# EAGLE design AnalogInputModule_r1 (EAGLE 7.7.0)
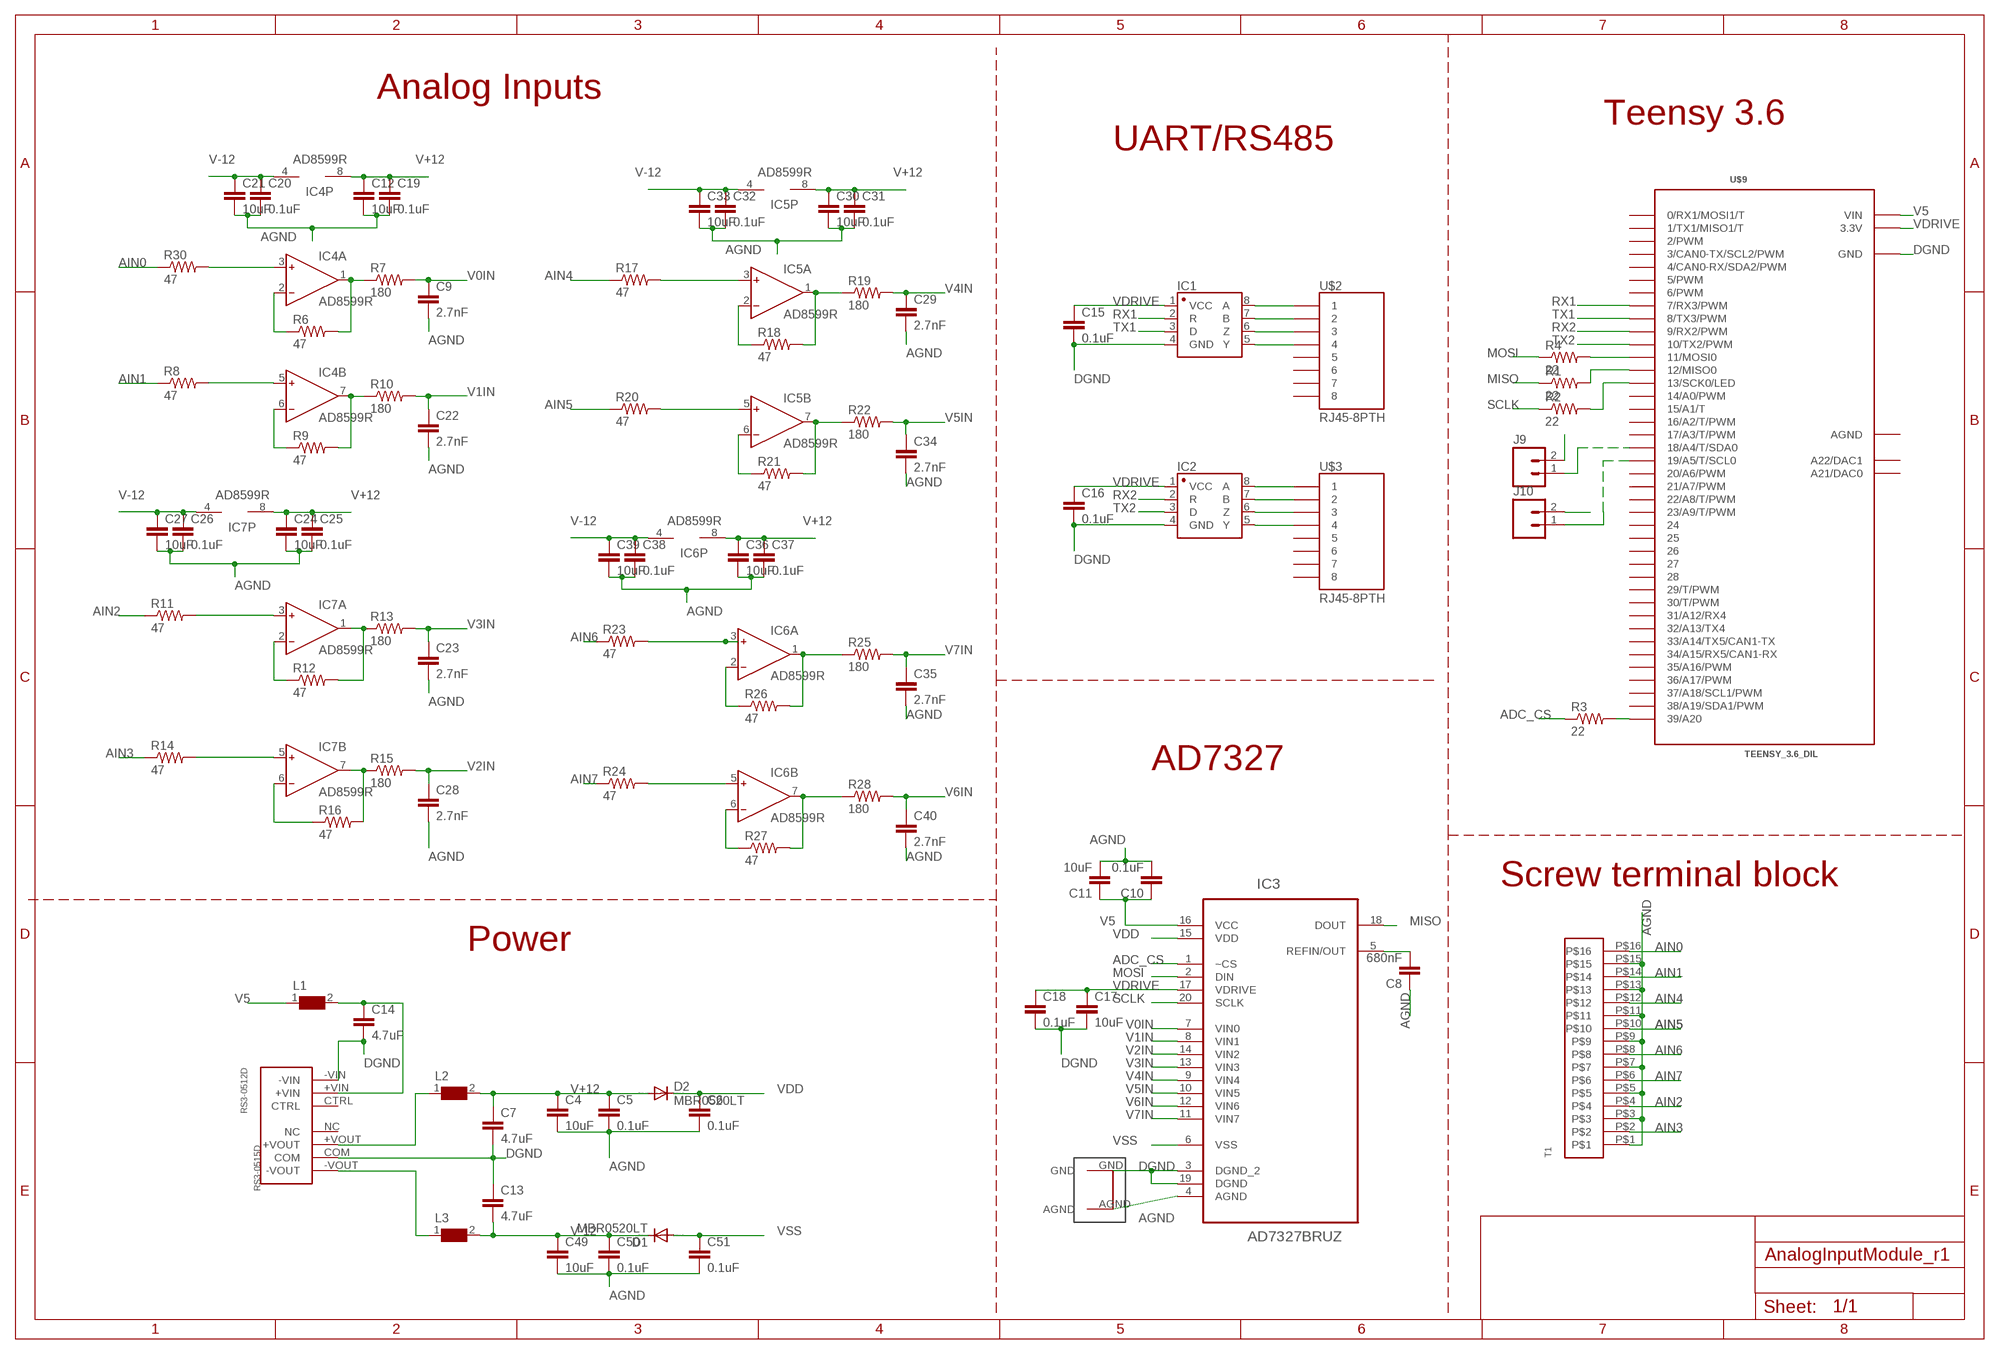
[diagram p0: schematic, sheet 1]

## Parts
C4  10uF  10UF-0805-10V-10%  [0805]
C5  0.1uF  1.0UF-0805-25V-10%  [0805]
C6  0.1uF  1.0UF-0805-25V-10%  [0805]
C7  4.7uF  4.7UF-1206-16V-(+80/-20%)  [1206]
C8  680nF  1.0UF-0805-25V-10%  [0805]
C9  2.7nF  1.0UF-0805-25V-10%  [0805]
C10  0.1uF  1.0UF-0805-25V-10%  [0805]
C11  10uF  10UF-0805-10V-10%  [0805]
C12  10uF  10UF-0805-10V-10%  [0805]
C13  4.7uF  4.7UF-1206-16V-(+80/-20%)  [1206]
C14  4.7uF  4.7UF-1206-16V-(+80/-20%)  [1206]
C15  0.1uF  1.0UF-0805-25V-10%  [0805]
C16  0.1uF  1.0UF-0805-25V-10%  [0805]
C17  10uF  10UF-0805-10V-10%  [0805]
C18  0.1uF  1.0UF-0805-25V-10%  [0805]
C19  0.1uF  1.0UF-0805-25V-10%  [0805]
C20  0.1uF  1.0UF-0805-25V-10%  [0805]
C21  10uF  10UF-0805-10V-10%  [0805]
C22  2.7nF  1.0UF-0805-25V-10%  [0805]
C23  2.7nF  1.0UF-0805-25V-10%  [0805]
C24  10uF  10UF-0805-10V-10%  [0805]
C25  0.1uF  1.0UF-0805-25V-10%  [0805]
C26  0.1uF  1.0UF-0805-25V-10%  [0805]
C27  10uF  10UF-0805-10V-10%  [0805]
C28  2.7nF  1.0UF-0805-25V-10%  [0805]
C29  2.7nF  1.0UF-0805-25V-10%  [0805]
C30  10uF  10UF-0805-10V-10%  [0805]
C31  0.1uF  1.0UF-0805-25V-10%  [0805]
C32  0.1uF  1.0UF-0805-25V-10%  [0805]
C33  10uF  10UF-0805-10V-10%  [0805]
C34  2.7nF  1.0UF-0805-25V-10%  [0805]
C35  2.7nF  1.0UF-0805-25V-10%  [0805]
C36  10uF  10UF-0805-10V-10%  [0805]
C37  0.1uF  1.0UF-0805-25V-10%  [0805]
C38  0.1uF  1.0UF-0805-25V-10%  [0805]
C39  10uF  10UF-0805-10V-10%  [0805]
C40  2.7nF  1.0UF-0805-25V-10%  [0805]
C49  10uF  10UF-0805-10V-10%  [0805]
C50  0.1uF  1.0UF-0805-25V-10%  [0805]
C51  0.1uF  1.0UF-0805-25V-10%  [0805]
D1  MBR0520LT  [SOD123]
D2  MBR0520LT  [SOD123]
IC1  SN65HVD31DR  [SO08]
IC2  SN65HVD31DR  [SO08]
IC3  AD7327BRUZ  [SOP65P640X120-20N]
IC4  AD8599R  [SO8]
IC5  AD8599R  [SO8]
IC6  AD8599R  [SO8]
IC7  AD8599R  [SO8]
J9  M023.5MM  [SCREWTERMINAL-3.5MM-2]
J10  M023.5MM  [SCREWTERMINAL-3.5MM-2]
L1  WE-CBF-742792118_1206  [1206]
L2  WE-CBF-742792118_1206  [1206]
L3  WE-CBF-742792118_1206  [1206]
R1  22  R-US_R0805  [R0805]
R2  22  R-US_R0805  [R0805]
R3  22  R-US_R0805  [R0805]
R4  22  R-US_R0805  [R0805]
R6  47  R-US_R0805  [R0805]
R7  180  R-US_R0805  [R0805]
R8  47  R-US_R0805  [R0805]
R9  47  R-US_R0805  [R0805]
R10  180  R-US_R0805  [R0805]
R11  47  R-US_R0805  [R0805]
R12  47  R-US_R0805  [R0805]
R13  180  R-US_R0805  [R0805]
R14  47  R-US_R0805  [R0805]
R15  180  R-US_R0805  [R0805]
R16  47  R-US_R0805  [R0805]
R17  47  R-US_R0805  [R0805]
R18  47  R-US_R0805  [R0805]
R19  180  R-US_R0805  [R0805]
R20  47  R-US_R0805  [R0805]
R21  47  R-US_R0805  [R0805]
R22  180  R-US_R0805  [R0805]
R23  47  R-US_R0805  [R0805]
R24  47  R-US_R0805  [R0805]
R25  180  R-US_R0805  [R0805]
R26  47  R-US_R0805  [R0805]
R27  47  R-US_R0805  [R0805]
R28  180  R-US_R0805  [R0805]
R30  47  R-US_R0805  [R0805]
RS3-0512D  RS3-0515D  [RS3-0515D]
T1  16POS_SCREWTERMINAL  [16POS_SCREWTERMINAL]
U$2  RJ45-8PTH  [RJ45-8]
U$3  RJ45-8PTH  [RJ45-8]
U$4  GNDPLANESHRT  [GNDPLANESHRT]
U$9  TEENSY_3.6_DIL  [TEENSY_3.6_DIL]

## Nets
+VOUT: L2.1 RS3-0512D.+VOUT
-VOUT: L3.1 RS3-0512D.-VOUT
ADC_CS: IC3.1(~CS) R3.1
AGND: C4.2 C5.2 C6.2 C8.1 C9.2 C10.2 C11.2 C12.2 C19.2 C20.2 C21.2 C22.2 C23.2 C24.2 C25.2 C26.2 C27.2 C28.2 C29.2 C30.2 C31.2 C32.2 C33.2 C34.2 C35.2 C36.2 C37.2 C38.2 C39.2 C40.2 C49.2 C50.2 C51.2 IC3.4(AGND) T1.P$1 T1.P$3 T1.P$5 T1.P$7 T1.P$9 T1.P$11 T1.P$13 T1.P$15 U$4.AGND
AIN0: R30.1 T1.P$16
AIN1: R8.1 T1.P$14
AIN2: R11.1 T1.P$4
AIN3: R14.1 T1.P$2
AIN4: R17.1 T1.P$12
AIN5: R20.1 T1.P$10
AIN6: R23.1 T1.P$8
AIN7: R24.1 T1.P$6
DGND: C7.2 C13.1 C14.2 C15.2 C16.2 C17.2 C18.2 IC1.4(GND) IC2.4(GND) IC3.3(DGND_2) IC3.19(DGND) J9.2 J10.2 RS3-0512D.-VIN RS3-0512D.COM U$4.GND U$9.GND U$9.GND1(GND)
MISO: IC3.18(DOUT) R1.1
MOSI: IC3.2(DIN) R4.1
N$1: IC1.6(Z) U$2.3
N$3: IC1.8(A) U$2.1
N$4: IC1.5(Y) U$2.4
N$5: IC1.7(B) U$2.2
N$6: IC2.6(Z) U$3.3
N$7: IC2.5(Y) U$3.4
N$8: IC2.8(A) U$3.1
N$9: IC2.7(B) U$3.2
N$10: R4.2 U$9.11(11/MOSI0)
N$11: R1.2 U$9.12(12/MISO0)
N$12: C14.1 L1.2 RS3-0512D.+VIN
N$13: R3.2 U$9.39/A20
N$14: IC4.3(A:IN+) R30.2
N$15: R2.2 U$9.13(13/SCK0/LED)
N$16: IC4.2(A:IN-) R6.1
N$17: IC4.1(A:OUT) R6.2 R7.1
N$18: J9.1 U$9.18/A4(18/A4/T/SDA0)
N$19: J10.1 U$9.19/A5(19/A5/T/SCL0)
N$20: IC4.5(B:IN+) R8.2
N$21: IC4.6(B:IN-) R9.1
N$22: IC4.7(B:OUT) R9.2 R10.1
N$23: IC7.3(A:IN+) R11.2
N$24: IC7.2(A:IN-) R12.1
N$25: IC7.1(A:OUT) R12.2 R13.1
N$28: IC7.5(B:IN+) R14.2
N$29: IC7.6(B:IN-) R16.1
N$30: IC7.7(B:OUT) R15.1 R16.2
N$31: IC5.3(A:IN+) R17.2
N$32: IC5.2(A:IN-) R18.1
N$33: IC5.1(A:OUT) R18.2 R19.1
N$36: IC5.5(B:IN+) R20.2
N$37: IC5.6(B:IN-) R21.1
N$38: IC5.7(B:OUT) R21.2 R22.1
N$39: IC6.3(A:IN+) R23.2
N$40: IC6.2(A:IN-) R26.1
N$41: IC6.1(A:OUT) R25.1 R26.2
N$44: IC6.5(B:IN+) R24.2
N$45: IC6.6(B:IN-) R27.1
N$46: IC6.7(B:OUT) R27.2 R28.1
REF: C8.2 IC3.5(REFIN/OUT)
RX1: IC1.2(R) U$9.7(7/RX3/PWM)
RX2: IC2.2(R) U$9.9(9/RX2/PWM)
SCLK: IC3.20(SCLK) R2.1
TX1: IC1.3(D) U$9.8(8/TX3/PWM)
TX2: IC2.3(D) U$9.10(10/TX2/PWM)
V0IN: C9.1 IC3.7(VIN0) R7.2
V1IN: C22.1 IC3.8(VIN1) R10.2
V2IN: C28.1 IC3.14(VIN2) R15.2
V3IN: C23.1 IC3.13(VIN3) R13.2
V4IN: C29.1 IC3.9(VIN4) R19.2
V5: C10.1 C11.1 IC3.16(VCC) L1.1 U$9.VIN
V5IN: C34.1 IC3.10(VIN5) R22.2
V6IN: C40.1 IC3.12(VIN6) R28.2
V7IN: C35.1 IC3.11(VIN7) R25.2
V+12: C4.1 C5.1 C7.1 C12.1 C19.1 C24.1 C25.1 C30.1 C31.1 C36.1 C37.1 D2.A IC4.8(P:V+) IC5.8(P:V+) IC6.8(P:V+) IC7.8(P:V+) L2.2
V-12: C13.2 C20.1 C21.1 C26.1 C27.1 C32.1 C33.1 C38.1 C39.1 C49.1 C50.1 D1.C IC4.4(P:V-) IC5.4(P:V-) IC6.4(P:V-) IC7.4(P:V-) L3.2
VDD: C6.1 D2.C IC3.15(VDD)
VDRIVE: C15.1 C16.1 C17.1 C18.1 IC1.1(VCC) IC2.1(VCC) IC3.17(VDRIVE) U$9.3.3V U$9.3.3V3(3.3V)
VSS: C51.1 D1.A IC3.6(VSS)
Unconnected: RS3-0512D.CTRL RS3-0512D.NC U$2.5 U$2.6 U$2.7 U$2.8 U$3.5 U$3.6 U$3.7 U$3.8 U$9.0(0/RX1/MOSI1/T) U$9.1(1/TX1/MISO1/T) U$9.2(2/PWM) U$9.3(3/CAN0-TX/SCL2/PWM) U$9.4(4/CAN0-RX/SDA2/PWM) U$9.5(5/PWM) U$9.6(6/PWM) U$9.14/A0(14/A0/PWM) U$9.15/A1(15/A1/T) U$9.16/A2(16/A2/T/PWM) U$9.17/A3(17/A3/T/PWM) U$9.20/A6(20/A6/PWM) U$9.21/A7(21/A7/PWM) U$9.22/A8(22/A8/T/PWM) U$9.23/A9(23/A9/T/PWM) U$9.24 U$9.25 U$9.26 U$9.27 U$9.28 U$9.29(29/T/PWM) U$9.30(30/T/PWM) U$9.31/A12(31/A12/RX4) U$9.32/A13(32/A13/TX4) U$9.33/A14(33/A14/TX5/CAN1-TX) U$9.34/A15(34/A15/RX5/CAN1-RX) U$9.35/A16(35/A16/PWM) U$9.36/A17(36/A17/PWM) U$9.37/A18(37/A18/SCL1/PWM) U$9.38/A19(38/A19/SDA1/PWM) U$9.A21(A21/DAC0) U$9.A22(A22/DAC1)

## Notes on the sheet
- Analog Inputs
- Teensy 3.6
- UART/RS485
- AIN5
- AIN6
- AD7327
- AIN7
- Screw terminal block
- AGND
- Power | AIN0
- AIN1
- AIN4
- AIN5 | AIN5
- AIN6
- AIN7

## Power pins joined to a net without a drawn wire
AGND: U$9.AGND

## Library data of the parts
C4 C11 C12 C17 C21 C24 C27 C30 C33 C36 C39 C49 = SparkFun-Capacitors:10UF: 10.0µF ceramic capacitors A capacitor is a passive two-terminal electrical component used to store electrical energy temporarily in an electric field.; PROD_ID: CAP-11330
C5 C6 C8-C10 C15 C16 C18-C20 C22 C23 C25 C26 C28 C29 C31 C32 C34 C35 C37 C38 C40 C50 C51 = SparkFun-Capacitors:1.0UF: 1µF ceramic capacitors A capacitor is a passive two-terminal electrical component used to store electrical energy temporarily in an electric field.; PROD_ID: CAP-08064; VALUE: 1.0uF
C7 C13 C14 = SparkFun-Capacitors:4.7UF: 4.7µF ceramic capacitors A capacitor is a passive two-terminal electrical component used to store electrical energy temporarily in an electric field.; PROD_ID: CAP-10300
D1 D2 = diode:MBR0520LT: SCHOTTKY BARRIER RECTIFIER Source: http://onsemi.com .. MBR0520LT1-D.pdf
IC1 IC2 = Joshparts4:SN65HVD31DR: A placeholder for generic narrow & wide SOIC8 foorptints - used on the DIP adapter board.
IC3 = AD7327BRUZ:AD7327BRUZ: 500 kSPS, 8-Channel, Software-Selectable, True Bipolar Input, 12-Bit Plus Sign ADC; MPN: AD7327BRUZ; OC_FARNELL: 1274245; OC_NEWARK: 19M0860; PACKAGE: TSSOP-20; SUPPLIER: Analog devices
IC4-IC7 = analog-devices:AD8599: Single and Dual, Ultralow Distortion, Ultralow Noise Op Amps Source: http://www.analog.com/static/imported-files/data_sheets/AD8597_8599.pdf; MPN: AD8599ARZ; OC_FARNELL: 1438872; OC_NEWARK: 34M5072
J9 J10 = SparkFun-Connectors:M02: Standard 2-pin 0.1" header. Use with - straight break away headers ( PRT-00116) - right angle break away headers (PRT-00553) - swiss pins (PRT-00743) - machine pins (PRT-00117) - female headers (PRT-00115) Molex polarized connector foot print use with: PRT-08233 with associated crimp pins and housings. 2.54_SCREWTERM for use with PRT-10571. 3.5mm Screw Terminal footprints for PRT-08084 5mm Screw Terminal footprints for use with PRT-08432; PROD_ID: CONN-08399
L1-L3 = WE-CBF:WE-CBF: SMD EMI Suppression Ferrite Beads WE-CBF - Excellent anti-EMI properties - Low DC-restistance - Impedances till 3000 ohms - Rated current up to 6 A -- Reliable Ni-Sn electrodes -- Perfect as data lined filter and for uncoupling of distribution voltage; MPN: 742792118; OC_FARNELL: 1800374; OC_NEWARK: 78R5648; PACKAGE: IND-1206; SUPPLIER: Wuerth Elektronik
R1-R4 R6-R28 R30 = adafruit:R-US_: RESISTOR, American symbol
RS3-0512D = JoshParts10:RS3-0515D
T1 = JoshParts10:16POS_SCREWTERMINAL
U$2 U$3 = SparkFun:RJ45-8: RJ45 Jack Simple RJ45, 8-pin connection - connector for common Cat5, Cat5e, and Cat6 Ethernet cables. Footprint not yet proven in production. Connector sku is PRT-00643; Breakout PCB sku is BOB-00716.
U$4 = Joshparts2:GNDPLANESHRT
U$9 = Teensy_3_and_LC_Series_Boards_v1.4:TEENSY_3.6_DIL: Teensy 3.6 DIL Package

## Board
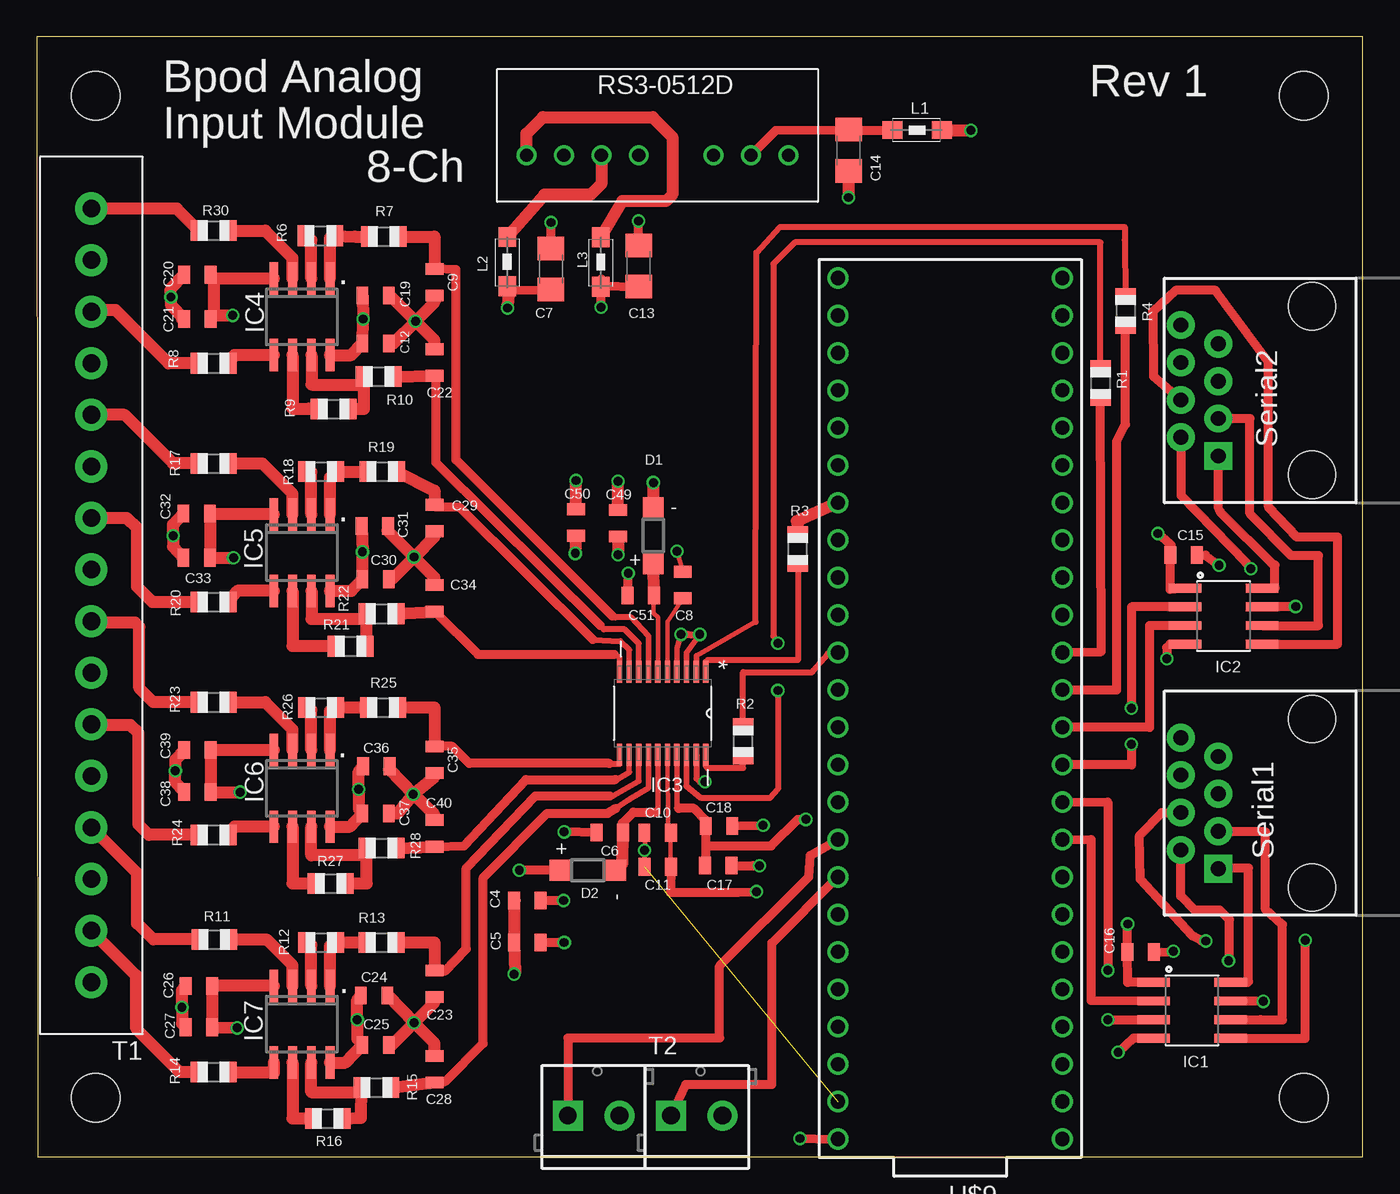
[diagram p1: board, top side]
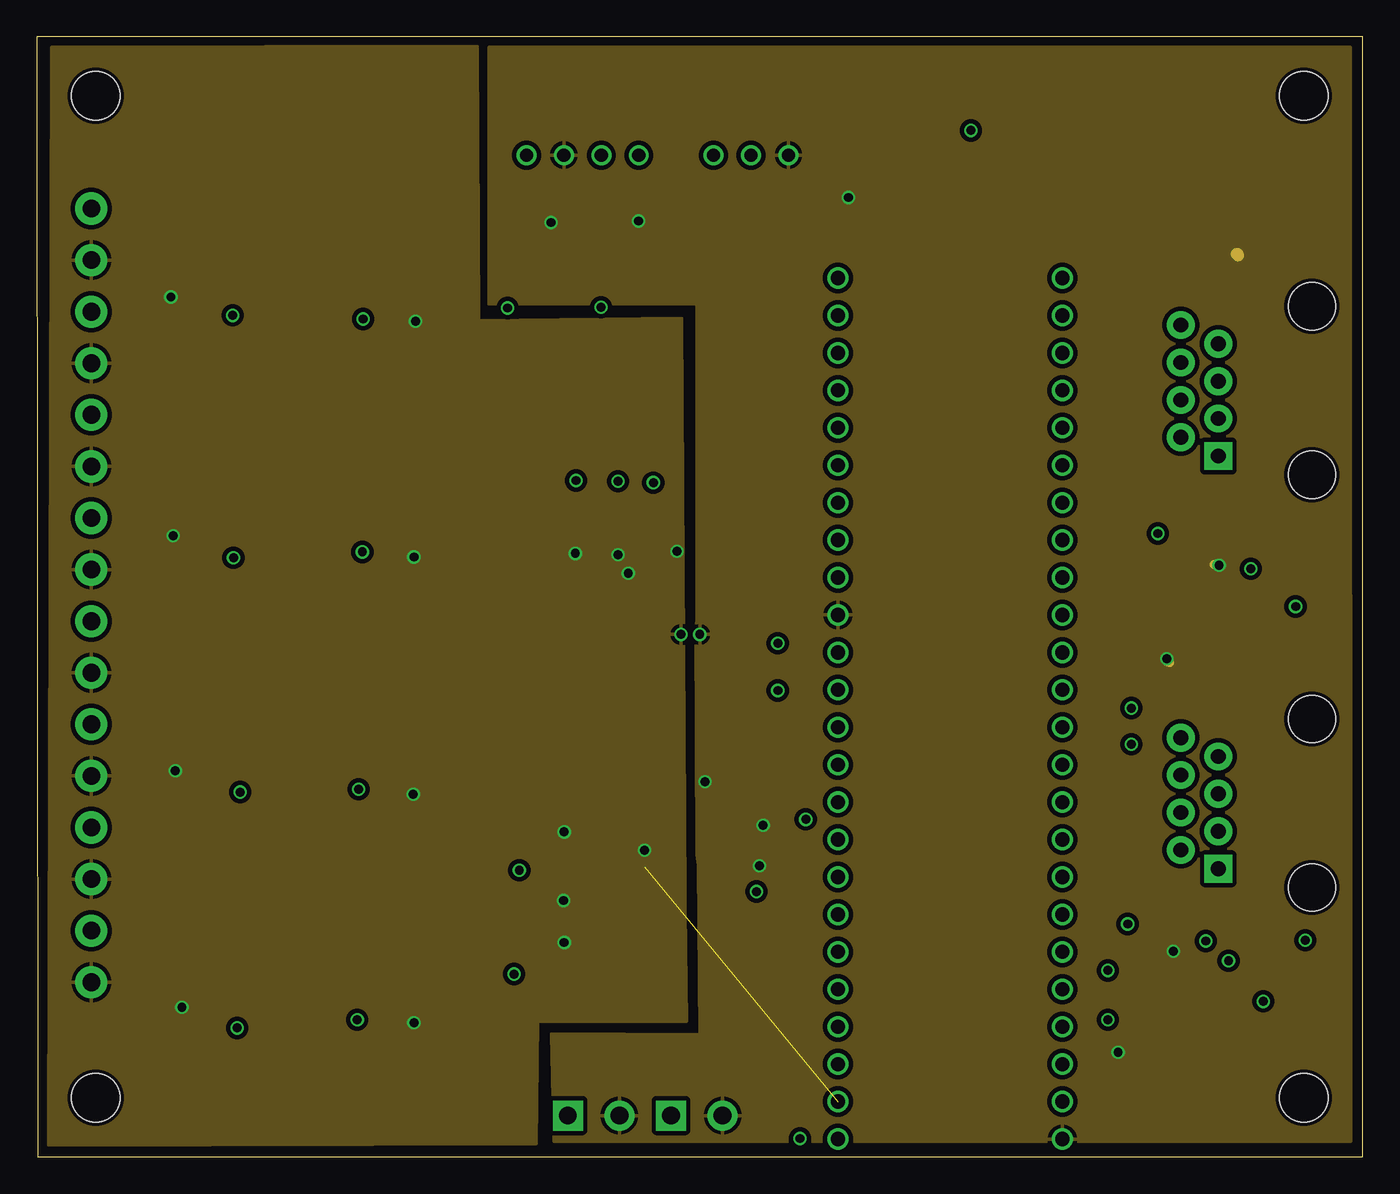
[diagram p2: board, inner layer Route2]
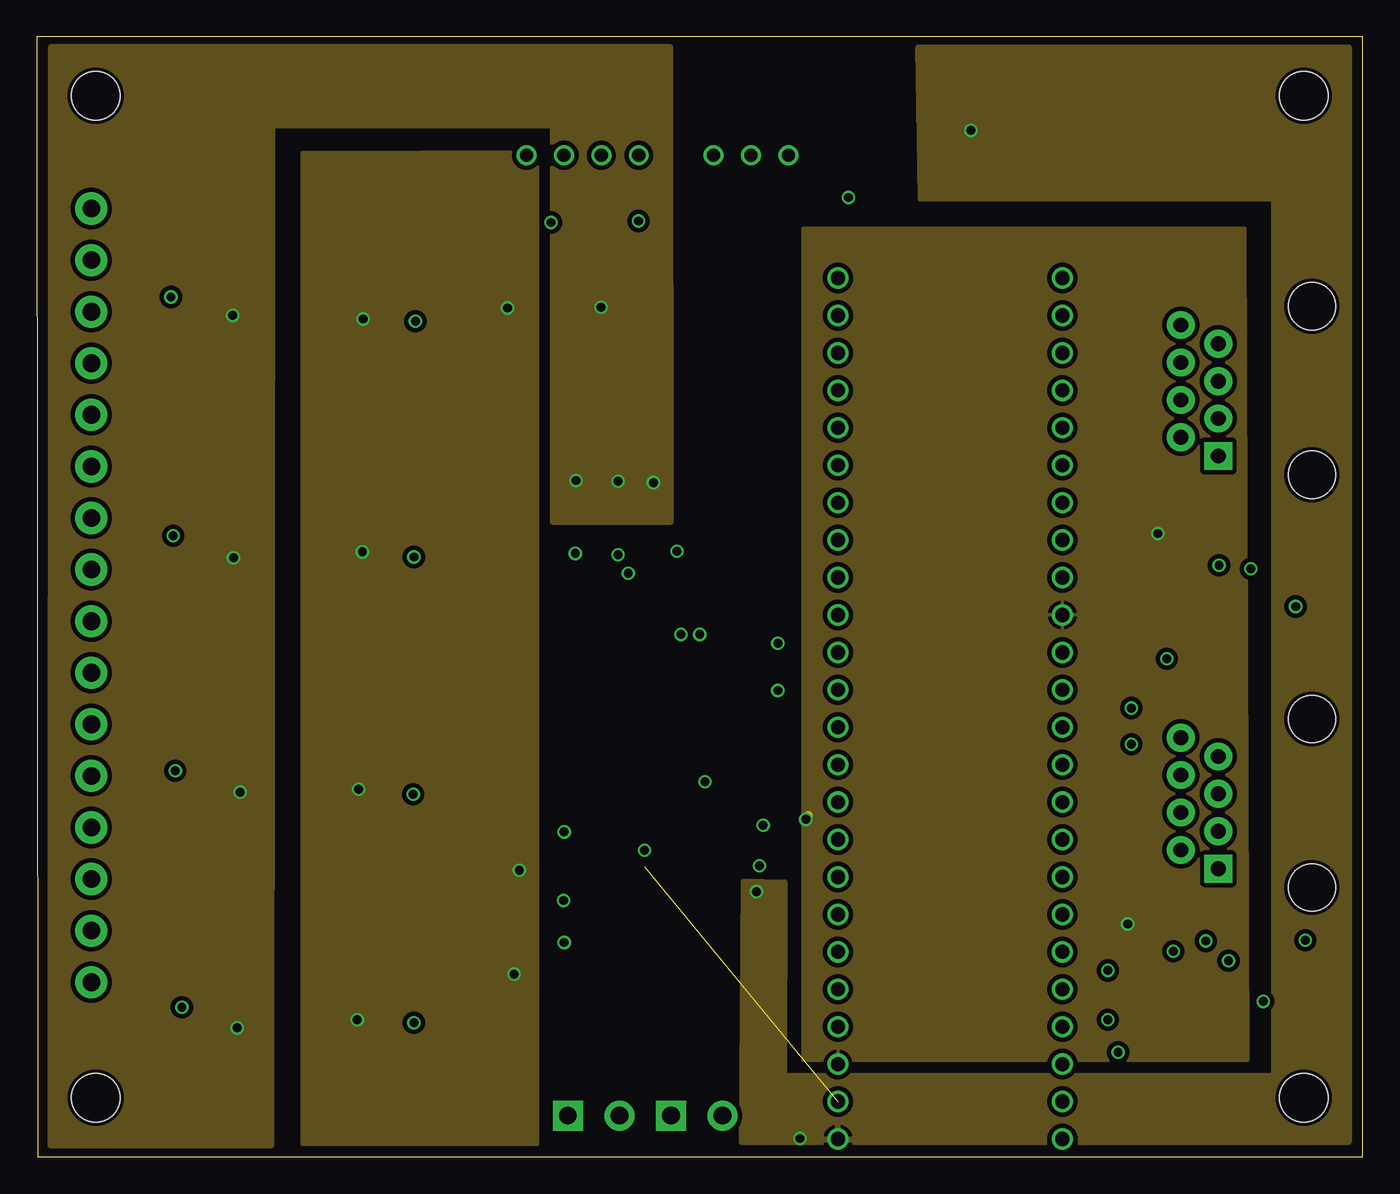
[diagram p3: board, inner layer Route15]
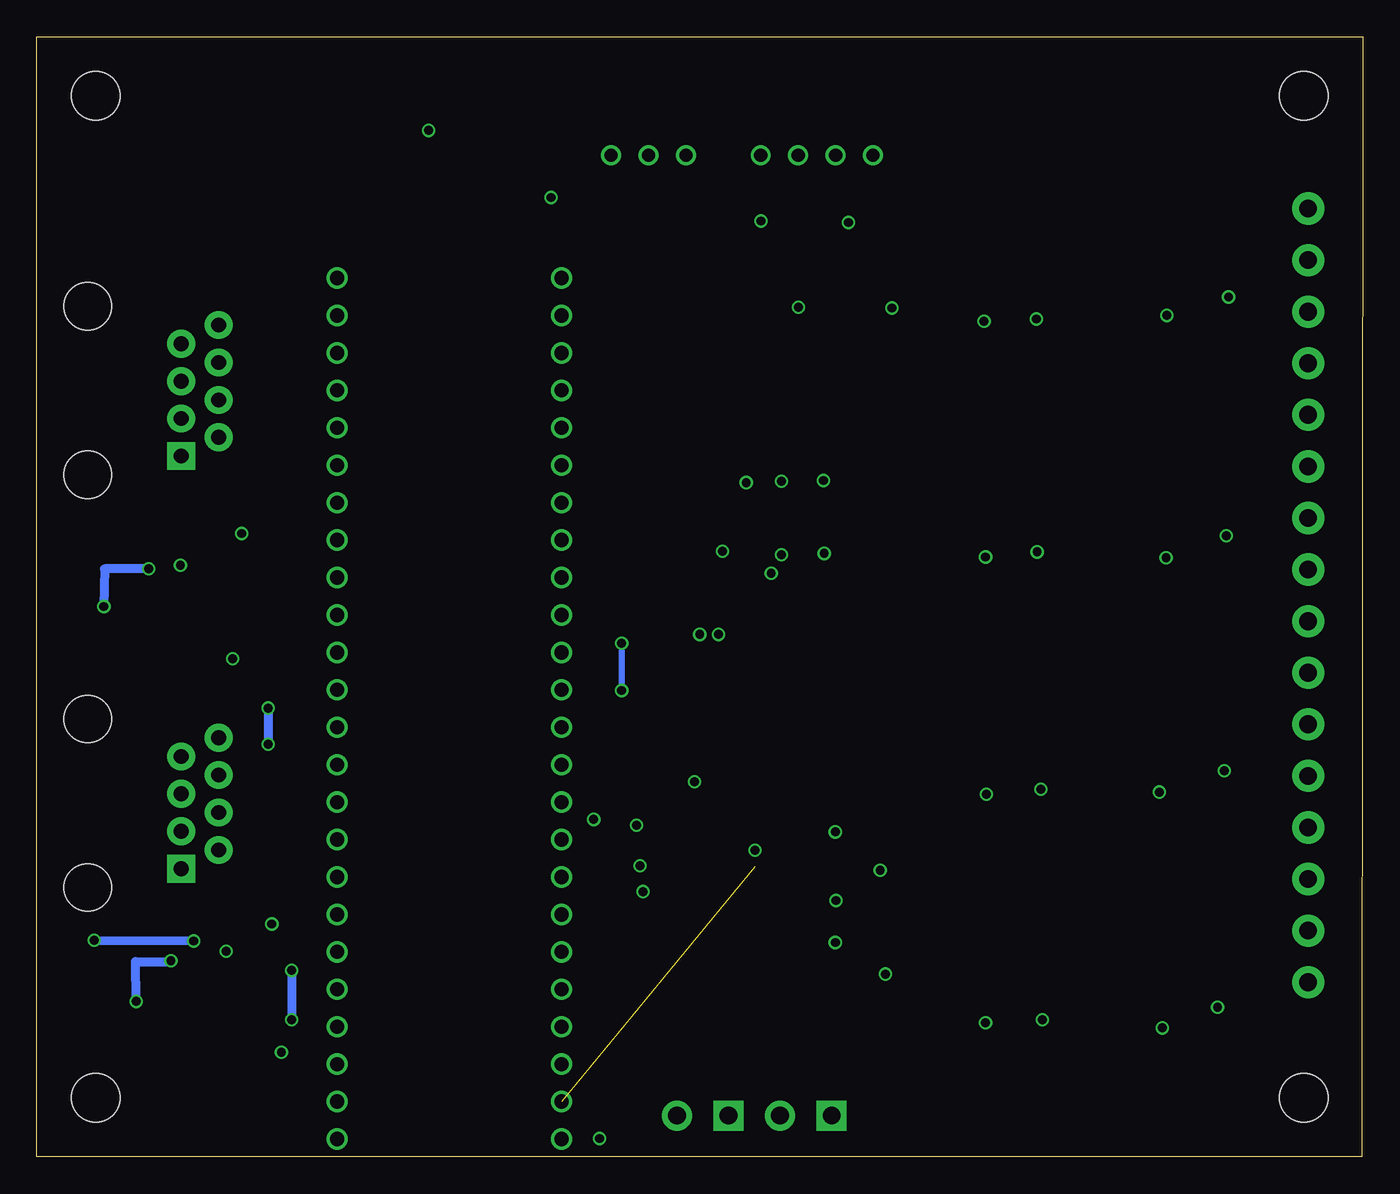
[diagram p4: board, bottom side, seen from below]

Size 90 x 76 mm. Coordinates in mm from the lower left corner, seen from the top.
Outline: 90,0 90,76 0,76 0.05,0 90,0
Copper layers (1*2*15*16): Top 0.035mm / dielectric 0.2mm / Route2 0.0175mm / dielectric 0.3mm / Route15 0.0175mm / dielectric 0.2mm / Bottom 0.035mm
Design rules "SeeedStudio_4layer_DRU_no_angle_20140221 *": minimum track width 8mil, minimum drill 12mil, track to track 12mil, track to pad 12mil, pad to pad 12mil, via to via 12mil, smd to smd 0mil, copper to edge 10mil, drill to drill 8mil, minimum pad ring 6mil, minimum via ring 4mil, stop-mask expansion 4mil, vias tented up to drill 25mil, thermal gap 10mil

### Footprints (pad centres in the part's own frame; a part is rotated, then mirrored left to right if it is on the bottom)
0805 = smd 0.8 x 1.2: 1 -0.9,0; 2 0.9,0
1206 = smd 1.6 x 1.8: 1 -1.4,0; 2 1.4,0
SOD123 = smd 1.4 x 1.4: A 1.9,0; C -1.9,0
SO08 = smd 0.61 x 2.21: 1 -1.905,-2.616; 2 -0.635,-2.616; 3 0.635,-2.616; 4 1.905,-2.616; 5 1.905,2.616; 6 0.635,2.616; 7 -0.635,2.616; 8 -1.905,2.616
SOP65P640X120-20N = smd 1.473 x 0.356: 1 -2.819,2.921; 2 -2.819,2.286; 3 -2.819,1.626; 4 -2.819,0.965; 5 -2.819,0.33; 6 -2.819,-0.33; 7 -2.819,-0.965; 8 -2.819,-1.626; 9 -2.819,-2.286; 10 -2.819,-2.921; 11 2.819,-2.921; 12 2.819,-2.286; 13 2.819,-1.626; 14 2.819,-0.965; 15 2.819,-0.33; 16 2.819,0.33; 17 2.819,0.965; 18 2.819,1.626; 19 2.819,2.286; 20 2.819,2.921
SO8 = smd 0.6 x 2.2: 1 -1.905,-2.6; 2 -0.635,-2.6; 3 0.635,-2.6; 4 1.905,-2.6; 5 1.905,2.6; 6 0.635,2.6; 7 -0.635,2.6; 8 -1.905,2.6
SCREWTERMINAL-3.5MM-2 = drill 1.2 pad 2.032 square: 1 0,0 | drill 1.2 pad 2.032: 2 3.5,0
1206' = smd 1.35 x 1.2: 1 -1.675,0; 2 1.675,0
R0805 = smd 1.1 x 1.4: 1 -1,0; 2 1,0
RS3-0515D = drill 0.9: +VIN 7.62,5.08; +VOUT 17.78,5.08; -VIN 5.08,5.08; -VOUT 22.86,5.08; COM 20.32,5.08; CTRL 10.16,5.08; NC 15.24,5.08
16POS_SCREWTERMINAL = drill 1.2 pad 2.184: P$1 0,0; P$2 3.5,0; P$3 7,0; P$4 10.5,0; P$5 14,0; P$6 17.5,0; P$7 21,0; P$8 24.5,0; P$9 28,0; P$10 31.5,0; P$11 35,0; P$12 38.5,0; P$13 42,0; P$14 45.5,0; P$15 49,0; P$16 52.5,0
RJ45-8 = drill 1 pad 1.88 square: 1 -4.445,6.35 | drill 1 pad 1.88: 2 -3.175,8.89; 3 -1.905,6.35; 4 -0.635,8.89; 5 0.635,6.35; 6 1.905,8.89; 7 3.175,6.35; 8 4.445,8.89 | hole 3.2: -5.715,0; 5.715,0
GNDPLANESHRT = drill 0.6: AGND -1.27,0; GND 0,0
STAND-OFF = hole 3.302: 0,0
TEENSY_3.6_DIL = drill 0.965: 0 -7.62,25.4; 1 -7.62,22.86; 2 -7.62,20.32; 3 -7.62,17.78; 3.3V 7.62,22.86; 3.3V3 -7.62,-7.62; 4 -7.62,15.24; 5 -7.62,12.7; 6 -7.62,10.16; 7 -7.62,7.62; 8 -7.62,5.08; 9 -7.62,2.54; 10 -7.62,0; 11 -7.62,-2.54; 12 -7.62,-5.08; 13 7.62,-5.08; 14/A0 7.62,-2.54; 15/A1 7.62,0; 16/A2 7.62,2.54; 17/A3 7.62,5.08; 18/A4 7.62,7.62; 19/A5 7.62,10.16; 20/A6 7.62,12.7; 21/A7 7.62,15.24; 22/A8 7.62,17.78; 23/A9 7.62,20.32; 24 -7.62,-10.16; 25 -7.62,-12.7; 26 -7.62,-15.24; 27 -7.62,-17.78; 28 -7.62,-20.32; 29 -7.62,-22.86; 30 -7.62,-25.4; 31/A12 -7.62,-27.94; 32/A13 -7.62,-30.48; 33/A14 7.62,-30.48; 34/A15 7.62,-27.94; 35/A16 7.62,-25.4; 36/A17 7.62,-22.86; 37/A18 7.62,-20.32; 38/A19 7.62,-17.78; 39/A20 7.62,-15.24; A21 7.62,-12.7; A22 7.62,-10.16; AGND 7.62,25.4; GND -7.62,27.94; GND1 7.62,-7.62; VIN 7.62,27.94

### Placement (x,y rotation side)
C4  33.3,17.4 0 top
C5  33.3,14.55 0 top
C6  38.9,22 180 top
C7  34.9,60.25 90 top
C8  43.85,38.8 270 top
C9  27,59.35 270 top
C10  42.14,21.99 180 top
C11  42.15,19.69 180 top
C12  23,55.2 0 top
C13  40.85,60.45 270 top
C14  55.1,68.3 270 top
C15  77.84,40.83 0 top
C16  74.93,13.89 0 top
C17  46.26,19.76 0 top
C18  46.3,22.46 0 top
C19  23,58.45 0 top
C20  10.9,59.85 180 top
C21  10.9,56.85 180 top
C22  27,53.9 90 top
C23  27,11.75 270 top
C24  22.9,10.95 0 top
C25  23,7.6 0 top
C26  11,11.6 180 top
C27  11,8.8 180 top
C28  27,5.95 90 top
C29  27,43.35 270 top
C30  23,39.2 0 top
C31  22.95,42.8 0 top
C32  10.85,43.65 180 top
C33  10.85,40.65 180 top
C34  27,37.9 90 top
C35  27,26.95 270 top
C36  23.05,26.5 0 top
C37  23,23.3 0 top
C38  10.9,24.75 180 top
C39  10.9,27.6 180 top
C40  27,21.95 90 top
C49  39.45,43 270 top
C50  36.6,43.05 270 top
C51  41,38.1 180 top
D1  41.85,42.15 270 top
D2  37.4,19.45 180 top
IC1  78.41,9.94 270 top
IC2  80.56,36.69 270 top
IC3  42.48,30.1 270 top
IC4  18,57 180 top
IC5  18,41 180 top
IC6  18,25 180 top
IC7  18,9 180 top
J9  36.05,2.8 0 top
J10  43.05,2.8 0 top
L1  [1206']  59.76,69.67 180 top
L2  [1206']  31.93,60.74 270 top
L3  [1206']  38.28,60.72 270 top
R1  72.2,52.5 270 top
R2  47.95,28.2 90 top
R3  51.65,41.25 90 top
R4  73.9,57.4 270 top
R6  19.25,62.5 0 top
R7  23.55,62.45 0 top
R8  12,53.85 0 top
R9  20.15,50.75 0 top
R10  23.2,52.95 0 top
R11  12.05,14.75 0 top
R12  19.3,14.55 0 top
R13  23.4,14.55 0 top
R14  12,5.75 0 top
R15  23.05,4.7 0 top
R16  19.75,2.6 0 top
R17  12,47.05 0 top
R18  19.3,46.5 0 top
R19  23.45,46.5 0 top
R20  12,37.65 0 top
R21  21.3,34.65 0 top
R22  23.4,36.85 0 top
R23  12,30.85 0 top
R24  12,21.85 0 top
R25  23.5,30.5 0 top
R26  19.3,30.5 0 top
R27  19.95,18.55 0 top
R28  23.4,20.95 0 top
R30  12,62.85 0 top
RS3-0512D  56.1,73.05 180 top
T1  3.7,11.85 90 top
U$2  86.55,24 90 top
U$3  86.55,52 90 top
U$4  45,35.45 0 top
U$5  [STAND-OFF]  4,4 0 top
U$6  [STAND-OFF]  86,4 0 top
U$7  [STAND-OFF]  4,72 0 top
U$8  [STAND-OFF]  86,72 0 top
U$9  62,29.15 180 top

### Tracks (layer width: path | path; a pad name or v marks a point on that pad's centre or on a via)
+VOUT
  Top 0.61: L2.1 31.97,62.8
  Top 0.813: RS3-0512D.+VOUT 38.32,66.02 37.6,65.3 34.47,65.3 L2.1
-VOUT
  Top 0.813: RS3-0512D.-VOUT 33.24,69.44 34.35,70.55 41.8,70.55 43.15,69.2 43.15,65.3 42.7,64.85 39.73,64.85 L3.1
ADC_CS
  Top 0.25: IC3.1 45.4,33.6
  Top 0.305: 45.42,32.9 IC3.1
  Top 0.375: 45.4,33.6 45.55,33.7
  Top 0.406: R3.1 51.65,33.7 45.55,33.7
AGND  (via drill 0.6, 0.6 pad 0.25)  (1 unrouted)
  Top 0.305: IC3.4 | C8.1 v43.45,41.1 | C10.2 41.29,20.84 v41.25,20.8 C11.2
  Top 0.375: IC3.4 43.45,34.52 U$4.AGND
  Top 0.5: U$4.AGND 44.9,35.4
  Top 0.61: C6.2 v35.8,22.05 | C4.2 v35.75,17.4 | C5.2 v35.8,14.55 | C51.2 v40.15,39.6
  Top 0.813: C50.2 v36.55,40.95 | C49.2 v39.45,40.85 | C12.2 24.2,55.2 v25.7,56.7 | 9.95,59.85 C20.2 9.1,58.9 v9.1,58.35 9.1,57.8 C21.2 9.85,56.85 | C22.2 27,55.4 v25.7,56.7 | C9.2 27,58 v25.7,56.7 | C29.2 27,42.1 v25.6,40.7 | C34.2 27,39.3 v25.6,40.7 | C30.2 24.1,39.2 v25.6,40.7 | C33.2 9.25,41.4 v9.25,42.15 9.25,42.9 C32.2 | C19.2 23.95,58.45 v25.7,56.7 | C31.2 23.8,42.5 v25.6,40.7 | C39.2 9.4,26.95 v9.4,26.2 9.4,25.45 C38.2 | C35.2 27,25.8 v25.55,24.6 | C40.2 27,23.2 v25.55,24.6 | C36.2 23.9,26.3 v25.55,24.6 | C37.2 24.5,23.3 v25.55,24.6 | C26.2 9.85,11.3 v9.85,10.15 9.85,9.05 C27.2 | C24.2 v25.6,9.1 | C23.2 27,10.5 v25.6,9.1 | C28.2 27,7.7 v25.6,9.1 | C25.2 24.1,7.6 v25.6,9.1
  pour Route2: 1,75.3 29.9,75.35 30,56.75 43.75,56.9 44,17.55 44,16.75 44.1,9.2 34,9.2 33.9,0.9 0.8,0.8
AIN0
  Top 0.813: R30.1 9.5,64.35 T1.P$16
AIN1
  Top 0.813: R8.1 8.95,53.85 5.35,57.45 3.8,57.45 T1.P$14
AIN2
  Top 0.813: R11.1 7.9,14.75 6.8,15.85 6.8,19.25 T1.P$4
AIN3
  Top 0.813: R14.1 9.7,5.75 6.75,8.7 6.75,12.3 T1.P$2
AIN4
  Top 0.813: R17.1 9.25,47.05 5.95,50.35 T1.P$12
AIN5
  Top 0.813: R20.1 7.85,37.65 6.8,38.7 6.8,42.65 6.1,43.35 T1.P$10
AIN6
  Top 0.813: R23.1 7.9,30.85 6.95,31.8 6.95,35.95 6.65,36.25 3.8,36.25 T1.P$8
AIN7
  Top 0.813: R24.1 7.6,21.85 6.9,22.55 6.9,28.75 6.35,29.3 3.75,29.3 T1.P$6
DGND  (via drill 0.6, 0.6 pad 0.25, 0.6 pad 0.81)
  Top 0.375: IC3.3 44.11,34.21 U$4.GND
  Top 0.406: IC3.19 44.77,25.68 45,25.45 v45.35,25.45
  Top 0.61: IC1.4 74.44,8.05 v73.4,7.1 | C16.2 76.83,13.9 v77.15,13.95 | C13.1 v40.85,63.5 | C7.2 v34.9,63.4 | C18.2 49.16,22.51 v49.3,22.5 | C17.2 48.59,19.76 v49.05,19.75 | IC2.4 76.94,34.78 76.7,34.55 v76.7,33.8 | C15.2 79.32,40.83 v80.25,40.15
  Top 0.813: C14.2 v55.1,65.1
  Route2 0.61: v76.7,33.8 76.7,33.6 76.9,33.55 | v80.25,40.15 79.9,40.2
  Route2 0.8: 81.5,61.25 81.55,61.15 81.45,61.25
  Bottom 0.406: v45.35,25.45 45.4,25.4
  pour Route2: 89.15,75.3 89.2,1.05 35.1,1.05 34.95,8.35 45,8.3 44.9,19.8 44.8,20.5 44.75,36.2 44.8,36.05 44.8,57.9 30.7,57.85 30.7,75.3
MISO  (via drill 0.6)
  Top 0.375: 44.1,25.15 IC3.18
  Top 0.406: R1.1 72.2,62.05 51.45,62.05 50,60.6 50,35.35 v50.3,34.85 | v50.3,31.65 50.3,24.95 49.75,24.35 45.1,24.35 44.1,25.15
  Bottom 0.406: v50.3,34.85 v50.3,31.65
MOSI
  Top 0.375: 48.8,36.3 44.77,34.02 IC3.2
  Top 0.406: 48.8,36.3 48.85,61.35 50.45,63.1 73.85,63.1 73.85,62.2 R4.1
N$1
  Top 0.61: IC1.6 83.06,9.3 84.55,9.3 84.55,15.75 83.4,16.8 83.4,22.05 80.31,22.05 U$2.3
N$3
  Top 0.61: IC1.8 82.19,11.85 82.25,11.9 82.25,19.6 81.22,19.6 U$2.1
N$4  (via drill 0.6)
  Top 0.61: IC1.5 86.1,8.04 v86.1,14.7 | v79.35,14.65 79.05,14.65 78.45,15 74.9,18.85 74.85,21.8 76.35,23.35 77.64,23.35 U$2.4
  Bottom 0.61: v86.1,14.7 v79.35,14.65
N$5  (via drill 0.6)
  Top 0.61: IC1.7 82.72,10.57 v83.25,10.55 | v80.9,13.3 80.95,13.35 80.95,16.1 80.3,16.75 78.6,16.75 77.65,17.7 U$2.2
  Bottom 0.61: v83.25,10.55 83.3,13.25 81.2,13.25 v80.9,13.3
N$6
  Top 0.61: IC2.6 87,36.05 87,40.8 85.15,40.8 82.35,43.65 82.35,50.1 81.17,50.1 U$3.3
N$7
  Top 0.61: IC2.5 88.3,34.78 88.3,42.05 85.55,42.05 83.6,44.1 83.6,53.95 80,58.8 77.3,58.8 75.75,57.35 75.8,52.95 U$3.4
N$8
  Top 0.61: U$3.1 80.2,44.09 80.35,43.75 83.95,40.15 84.05,40.15 84.05,38.59 IC2.8
N$9  (via drill 0.6)
  Top 0.61: IC2.7 83.2,37.35 v85.45,37.35 | U$3.2 77.66,44.89 82.1,40.3 v82.4,39.9
  Bottom 0.61: 85.5,37.4 v85.45,37.35 85.4,39.9 v82.4,39.9
N$10
  Top 0.61: U$9.11 73.3,31.69 73.3,48.55 73.9,49.7 R4.2
N$11
  Top 0.61: U$9.12 72.25,34.28 R1.2
N$12
  Top 0.61: RS3-0512D.+VIN 50.16,69.65 C14.1 55.17,69.67 L1.2
N$13
  Top 0.813: U$9.39/A20 51.59,43.14 R3.2
N$14
  Top 0.813: IC4.3 17.36,60.98 15.5,62.85 R30.2
N$15
  Top 0.406: R2.2 47.95,32.9 52.65,32.9 52.7,33 53.7,34.15 54.3,34.15 U$9.13
N$16
  Top 0.813: IC4.2 18.64,62.22 R6.1
N$17
  Top 0.813: IC4.1 19.91,62.35 R6.2 21.6,62.45 R7.1
N$18
  Top 0.61: U$9.18/A4 52.5,20.45 52.4,19 46.35,12.95 46.35,8.05 36.05,8.05 J9.1
N$19
  Top 0.61: U$9.19/A5 49.9,14.51 49.9,4.9 44.05,4.9 J10.1
N$20
  Top 0.813: IC4.5 13.4,54.4 R8.2
N$21
  Top 0.813: IC4.6 17.36,50.77 18.46,50.77 R9.1
N$22
  Top 0.813: R9.2 22.2,50.75 R10.1 22.2,52.4 18.65,52.4 IC4.7
N$23
  Top 0.813: 13,14.85 R11.2 15.6,14.75 17.36,12.98 IC7.3
N$24
  Top 0.813: IC7.2 18.64,14.37 R12.1
N$25
  Top 0.813: IC7.1 19.91,14.3 R12.2 R13.1
N$28
  Top 0.813: R14.2 16,5.75 16,5.7 16.09,5.7 IC7.5
N$29
  Top 0.813: IC7.6 17.36,2.62 18.64,2.62 R16.1 18.73,2.56
N$30
  Top 0.813: R16.2 22,2.65 R15.1 22.05,4.4 18.64,4.4 IC7.7
N$31
  Top 0.813: R17.2 15.3,47.05 17.36,44.98 IC5.3
N$32
  Top 0.813: IC5.2 18.64,46.47 R18.1
N$33
  Top 0.813: IC5.1 19.91,46.1 R18.2 R19.1
N$36
  Top 0.813: IC5.5 13.6,38.4 R20.2
N$37
  Top 0.813: IC5.6 17.36,34.66 20.29,34.66 R21.1
N$38
  Top 0.813: R21.2 22.4,34.65 R22.1 22.4,36.5 18.65,36.5 IC5.7
N$39
  Top 0.813: IC6.3 17.36,28.98 15.5,30.85 R23.2
N$40
  Top 0.813: IC6.2 18.64,30.32 R26.1
N$41
  Top 0.813: IC6.1 19.91,30.25 R26.2 R25.1
N$44
  Top 0.813: IC6.5 13.4,22.4 R24.2
N$45
  Top 0.813: IC6.6 17.36,18.57 18.48,18.57 R27.1
N$46
  Top 0.813: R27.2 22.4,18.55 22.4,20.45 | R28.1 22.4,20.45 | 22.4,20.45 18.64,20.45 IC6.7
REF
  Top 0.305: IC3.5 42.81,36.31 C8.2
RX1
  Top 0.61: U$9.7 71.55,21.55 71.55,10.62 IC1.2
RX2  (via drill 0.6)
  Top 0.61: IC2.2 74.3,37.33 v74.3,30.45 | v74.3,28 74.3,26.6 U$9.9
  Bottom 0.61: v74.3,30.45 v74.3,28
SCLK
  Top 0.375: IC3.20 45.4,26.55 45.44,26.51
  Top 0.406: 45.44,26.51 45.52,26.4 47.95,26.4 R2.1
TX1  (via drill 0.6)
  Top 0.61: U$9.8 72.7,24.09 v72.7,12.65 | v72.7,9.3 75.15,9.3 IC1.3
  Bottom 0.61: v72.7,12.65 v72.7,9.3
TX2
  Top 0.61: IC2.3 75.53,36.05 75.53,29.15 U$9.10
V0IN
  Top 0.375: IC3.7 41.52,35.34
  Top 0.406: 41.52,35.34 40.35,36.6 39.25,36.6 39.05,36.7
  Top 0.61: 39.05,36.7 28.45,47.3 28.45,60.2 C9.1
  Top 0.813: R7.2 27,62.45 C9.1
V1IN
  Top 0.375: IC3.8 40.85,34.85
  Top 0.406: 40.85,34.85 39.9,35.8 38.5,35.8 38.25,36.05
  Top 0.61: 38.25,36.05 27.1,47.1 27.1,52.95 C22.1
  Top 0.813: R10.2 C22.1
V2IN
  Top 0.375: 41.52,25.05 41.52,27.27 IC3.14
  Top 0.406: 39.3,23.65 40.2,24.25 41.52,25.05
  Top 0.61: C28.1 27.7,5.1 30.3,7.7 30.3,18.95 34.65,23.3 38.75,23.3 39.3,23.65
  Top 0.813: R15.2 C28.1
V3IN
  Top 0.375: 40.85,25.5 IC3.13
  Top 0.406: 38.9,24.5 39.1,24.5 40.85,25.5
  Top 0.61: C23.1 27.7,12.6 29.15,14.1 29.15,19.6 33.85,24.5 38.9,24.5
  Top 0.813: R13.2 27,14.55 C23.1
V4IN
  Top 0.375: 40.2,34.4 IC3.9
  Top 0.406: 37.75,35.1 39.6,35 40.2,34.4
  Top 0.61: C29.1 27.1,44.1 28.65,44.1 37.75,35.1
  Top 0.813: R19.2 27,45.2 C29.1
V5  (via drill 0.6, 0.6 pad 0.25)
  Top 0.305: IC3.16 42.86,22.12 C10.1 42.99,19.7 C11.1
  Top 0.61: v51.8,1.25 53.93,1.2 U$9.VIN | C11.1 43,17.95 47.6,17.95 v48.85,18
  Top 0.813: L1.1 v63.4,69.65
  pour Route15: 50.75,18.65 50.7,5.5 84,5.5 84,65 60,65 59.85,75.3 89.05,75.3 89.05,1 47.85,1 48,18.7
V5IN
  Top 0.375: 39.55,33.9 IC3.10
  Top 0.406: 27.05,37 C34.1 | 39.2,34.1 39.55,33.9
  Top 0.61: 27.05,37 29.95,34.1 39.2,34.1
  Top 0.813: R22.2 C34.1
V6IN
  Top 0.375: 40.2,26.1 IC3.12
  Top 0.406: 39.25,25.6 39.45,25.65 40.2,26.1
  Top 0.61: C40.1 29,21.1 33.2,25.6 39.25,25.6
  Top 0.813: R28.2 C40.1
V7IN
  Top 0.375: IC3.11 39.56,26.66 39.55,26.65
  Top 0.406: 39.55,26.65 39.05,26.65 38.85,26.7
  Top 0.61: 38.85,26.7 29.35,26.7 28.2,27.85 C35.1
  Top 0.813: R25.2 27,30.5 C35.1
V+12  (via drill 0.6 pad 0.25)
  Top 0.61: L2.2 32.05,58.8 C7.1 | D2.A v32.75,19.45
  Top 0.813: 32.46,17.41 C4.1 C5.1 32.45,12.45 v32.4,12.4 | IC7.8 20.95,6.4 C25.1 21.75,8 v21.75,9.3 21.75,10.65 C24.1 | IC6.8 21.25,22.4 C37.1 21.85,23.6 v21.85,24.95 21.85,26.15 C36.1 | IC5.8 21.35,38.4 C30.1 v22.1,41.05 C31.1 | IC4.8 21.35,54.4 C12.1 v22.15,56.85 C19.1 | 32.05,58.8 31.95,57.8 v31.95,57.6
  pour Route15: 18,68.15 18,0.85 34,0.85 34,68.2
V-12  (via drill 0.6 pad 0.25)
  Top 0.61: C13.2 38.23,59.1 L3.2 38.3,59.56 v38.3,57.65
  Top 0.813: C50.1 v36.6,45.9 | D1.C v41.85,45.75 | C49.1 v39.45,45.85 | IC4.4 12,59.6 | 12,59.6 C20.1 | IC5.4 11.75,43.6 | IC6.4 C39.1 C38.1 v13.8,24.75 | IC7.4 C26.1 C27.1 v13.6,8.75 | C32.1 11.75,43.6 | 11.75,43.6 C33.1 v13.35,40.65 | 12,59.6 12,57.1 | 12,57.1 C21.1 | 12,57.1 v13.3,57.1
  pour Route15: 35,43.1 43.05,43.1 43,75.3 0.95,75.3 0.9,0.8 15.95,0.8 16,70 35,70
VDD
  Top 0.375: 42.15,23.36 IC3.15
  Top 0.406: 42.05,23.4 42.05,23.5 42.15,23.36
  Top 0.61: C6.1 39.75,22.65 40.5,23.4 42.05,23.4
  Top 0.813: D2.C 39.75,19.9 C6.1
VDRIVE  (via drill 0.6)
  Top 0.305: 45.4,19.92 C17.1 45.41,21.1
  Top 0.375: 43.45,23.68 IC3.17
  Top 0.406: 43.56,23.65 43.5,23.65 43.45,23.68
  Top 0.61: IC1.1 74.04,11.84 C16.1 74.03,15.9 v74.05,15.8 | v76.1,42.3 76.98,41.53 C15.1 76.94,38.49 IC2.1 | 45.4,19.92 C18.1 45.4,22.85 44.6,23.65 43.56,23.65 | 45.41,21.1 49.85,21.1 51.65,22.9 v52.2,22.9
  Route15 0.61: v52.2,22.9 52.2,23 52.35,23.15
  pour Route15: 82.2,6.55 52,6.55 52,63 82,63
VSS
  Top 0.305: C51.1 41.85,36.9 42.15,36.6 IC3.6
  Top 0.813: C51.1 D1.A

### Text on the board
tPlace: . | Serial2 | - | . | + | . | + | Serial1 | - | . | T2
tNames: Bpod Analog | Rev 1 | Input Module | 8-Ch